# EAGLE design Main board schematics - JLC version (EAGLE 9.6.2)

## Sheet 1 of 3
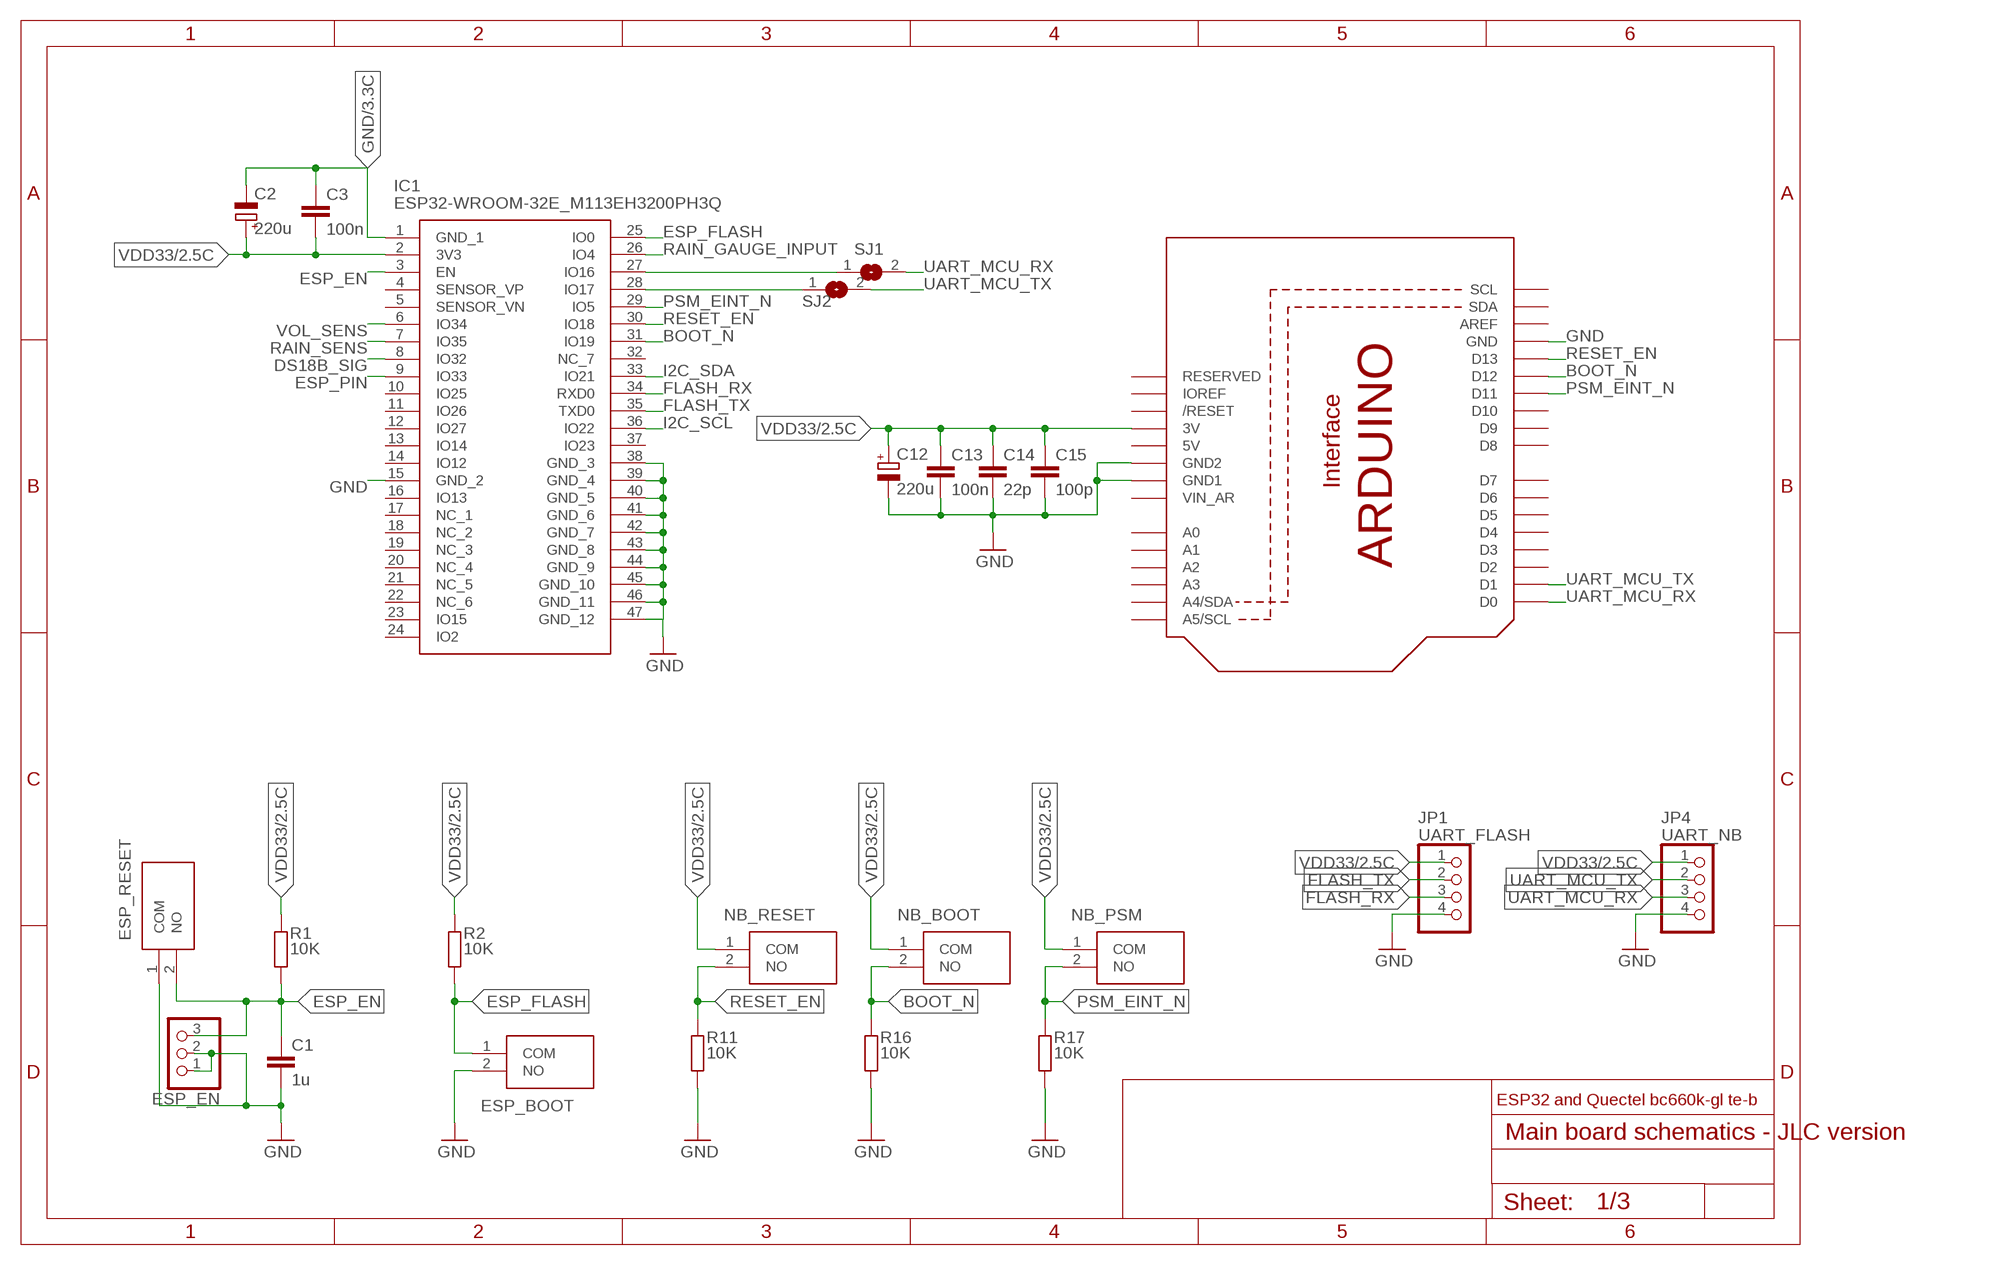
[diagram p0: schematic, sheet 1]

### Parts
C1  1u  C-EUC0805  [C0805]
C2  220u  CPOL-EUD  [PANASONIC_D]
C3  100n  C-EUC0805  [C0805]
C12  220u  CPOL-EUD  [PANASONIC_D]
C13  100n  C-EUC0805  [C0805]
C14  22p  C-EUC0805  [C0805]
C15  100p  C-EUC0805  [C0805]
ESP_BOOT  TS-1088-AR02016  [TS1088AR02016]
ESP_EN  PINHD-1X3  [1X03]
ESP_RESET  TS-1088-AR02016  [TS1088AR02016]
IC1  ESP32-WROOM-32E_M113EH3200PH3Q  [ESP32WROOM32EM113EH3200PH3Q0]
JP1  UART_FLASH  PINHD-1X4  [1X04]
JP4  UART_NB  PINHD-1X4  [1X04]
NB_BOOT  TS-1088-AR02016  [TS1088AR02016]
NB_PSM  TS-1088-AR02016  [TS1088AR02016]
NB_RESET  TS-1088-AR02016  [TS1088AR02016]
R1  10K  R-EU_R0805  [R0805]
R2  10K  R-EU_R0805  [R0805]
R11  10K  R-EU_R0805  [R0805]
R16  10K  R-EU_R0805  [R0805]
R17  10K  R-EU_R0805  [R0805]
SJ1  SJ  [SJ]
SJ2  SJ  [SJ]
U1  ARDUINOR3-BPLACE  [ARDUINOR3]

### Nets
BOOT_N: IC1.31(IO19) NB_BOOT.2(NO) R16.2 U1.D12
DS18B_SIG: IC1.8(IO32) ; also sheet 3
ESP_EN: C1.1 ESP_EN.3 ESP_RESET.2(NO) IC1.3(EN) R1.1
ESP_FLASH: ESP_BOOT.1(COM) IC1.25(IO0) R2.1
ESP_PIN: IC1.9(IO33) ; also sheet 3
FLASH_RX: IC1.34(RXD0) JP1.3
FLASH_TX: IC1.35(TXD0) JP1.2
GND: C1.2 C2.- C3.1 C12.- C13.2 C14.2 C15.2 ESP_BOOT.2(NO) ESP_EN.1 ESP_EN.2 ESP_RESET.1(COM) IC1.1(GND_1) IC1.15(GND_2) IC1.38(GND_3) IC1.39(GND_4) IC1.40(GND_5) IC1.41(GND_6) IC1.42(GND_7) IC1.43(GND_8) IC1.44(GND_9) IC1.45(GND_10) IC1.46(GND_11) IC1.47(GND_12) JP1.4 JP4.4 R11.1 R16.1 R17.1 U1.D14(GND) U1.GND U1.GND1 U1.GND2 ; also sheet 2,3
I2C_SCL: IC1.36(IO22) ; also sheet 3
I2C_SDA: IC1.33(IO21) ; also sheet 3
N$1: IC1.27(IO16) SJ1.1
N$2: IC1.28(IO17) SJ2.1
PSM_EINT_N: IC1.29(IO5) NB_PSM.2(NO) R17.2 U1.D11
RAIN_GAUGE_INPUT: IC1.26(IO4) ; also sheet 3
RAIN_SENS: IC1.7(IO35)
RESET_EN: IC1.30(IO18) NB_RESET.2(NO) R11.2 U1.D13
UART_MCU_RX: JP4.3 SJ1.2 U1.D0
UART_MCU_TX: JP4.2 SJ2.2 U1.D1
VDD33: C2.+ C3.2 C12.+ C13.1 C14.1 C15.1 IC1.2(3V3) JP1.1 JP4.1 NB_BOOT.1(COM) NB_PSM.1(COM) NB_RESET.1(COM) R1.2 R2.2 U1.VBAT(3V) ; also sheet 2,3
VOL_SENS: IC1.6(IO34) ; also sheet 3
Unconnected: IC1.4(SENSOR_VP) IC1.5(SENSOR_VN) IC1.10(IO25) IC1.11(IO26) IC1.12(IO27) IC1.13(IO14) IC1.14(IO12) IC1.16(IO13) IC1.17(NC_1) IC1.18(NC_2) IC1.19(NC_3) IC1.20(NC_4) IC1.21(NC_5) IC1.22(NC_6) IC1.23(IO15) IC1.24(IO2) IC1.32(NC_7) IC1.37(IO23) U1.A0 U1.A1 U1.A2 U1.A3 U1.A4(A4/SDA) U1.A5(A5/SCL) U1.AREF U1.D2 U1.D3 U1.D4 U1.D5 U1.D6 U1.D7 U1.D8 U1.D9 U1.D10 U1.IOREF U1.RESERVED U1.RESET(/RESET) U1.SCL U1.SDA

### Notes on the sheet
- ESP32 and Quectel bc660k-gl te-b

## Sheet 2 of 3
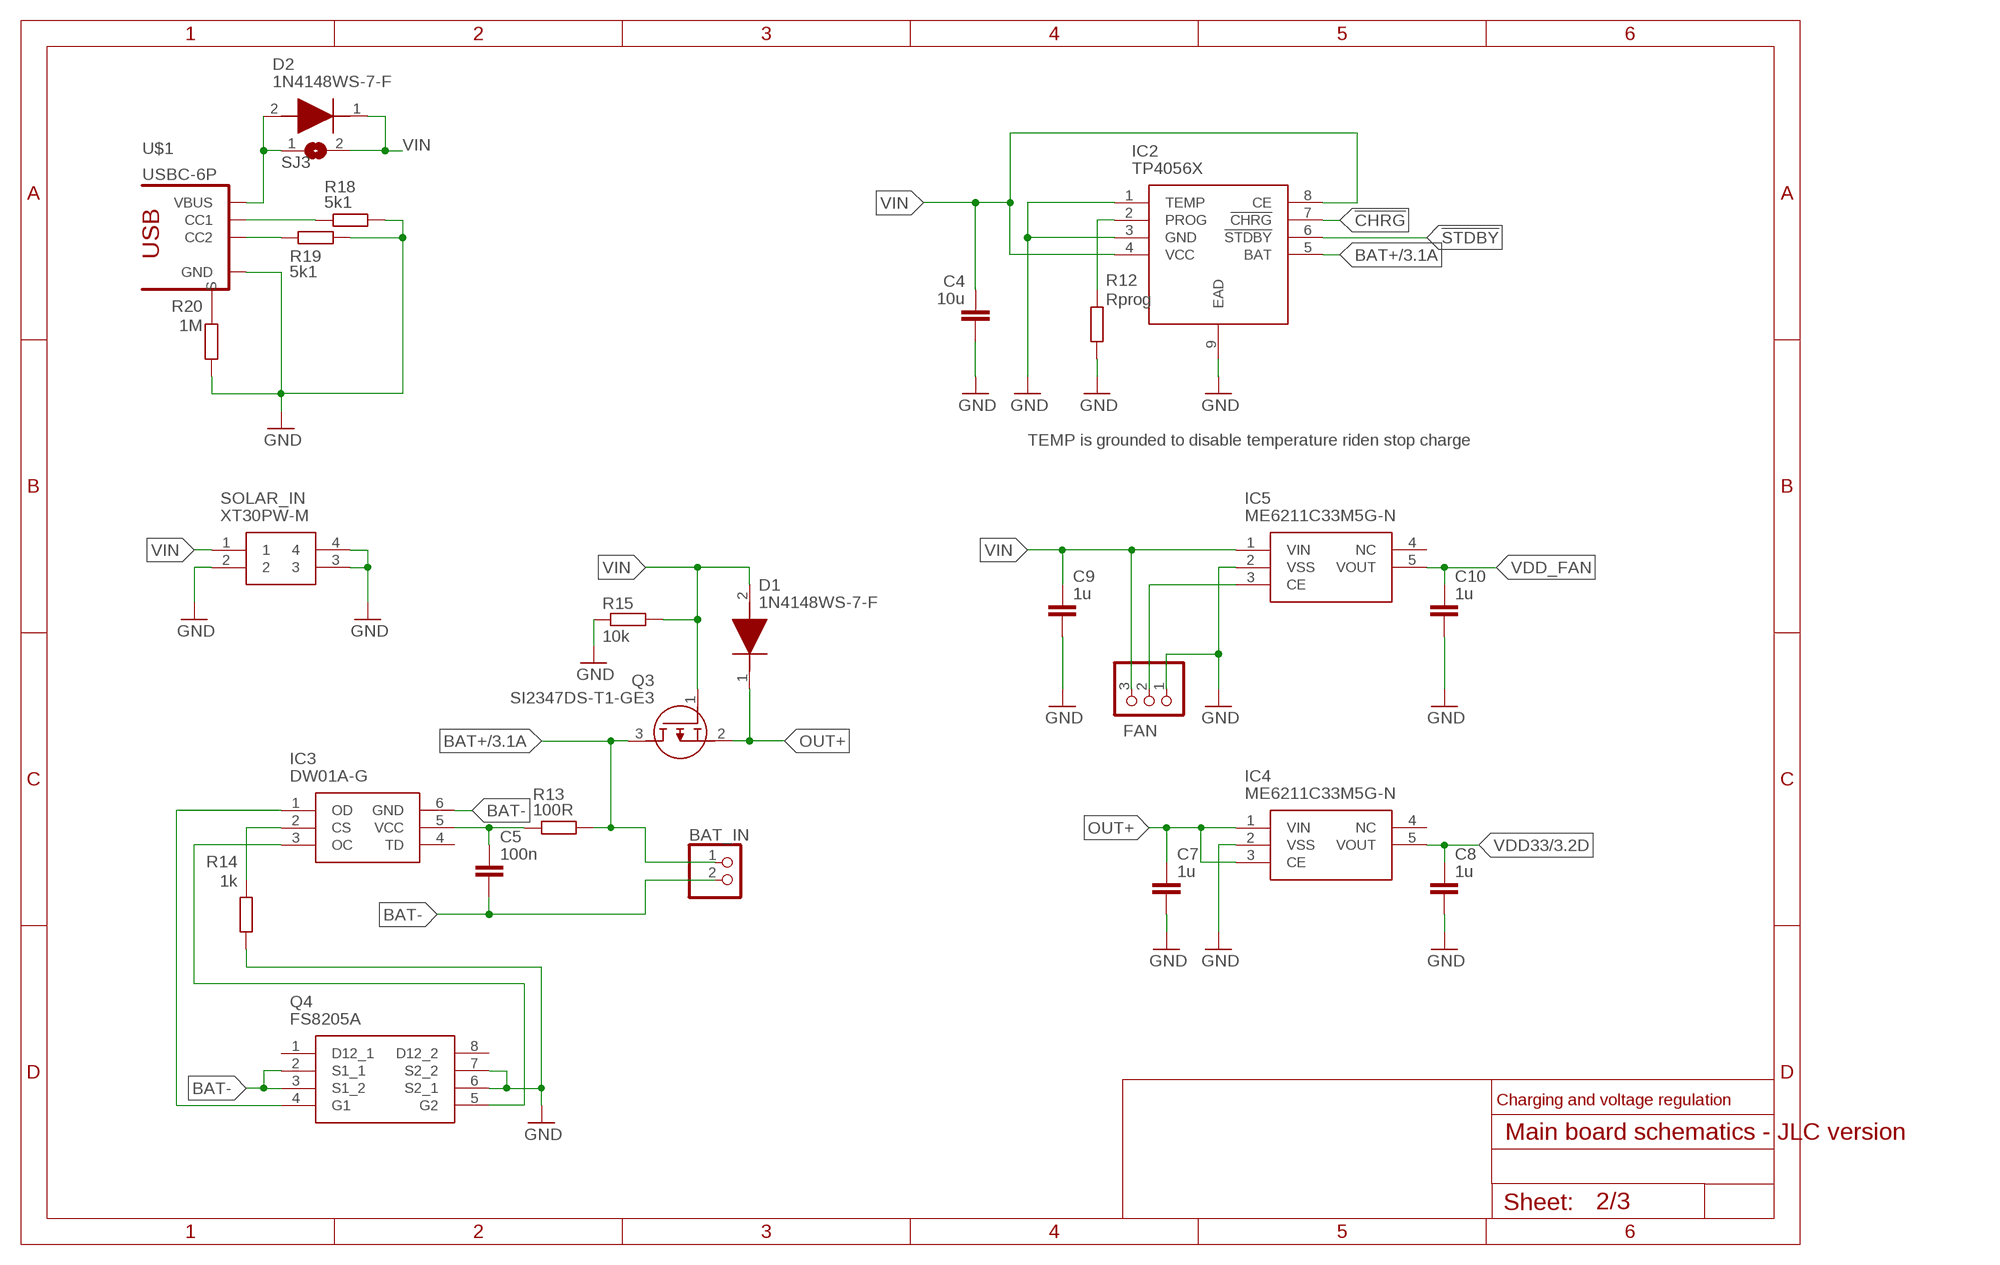
[diagram p1: schematic, sheet 2]

### Parts
BAT_IN  PINHD-1X2  [1X02]
C4  10u  C-EUC0805  [C0805]
C5  100n  C-EUC0805  [C0805]
C7  1u  C-EUC0805  [C0805]
C8  1u  C-EUC0805  [C0805]
C9  1u  C-EUC0805  [C0805]
C10  1u  C-EUC0805  [C0805]
D1  1N4148WS-7-F  [SOD2513X120N]
D2  1N4148WS-7-F  [SOD2513X120N]
FAN  PINHD-1X3  [1X03]
IC2  TP4056X  [SOIC127P600X175-9N]
IC3  DW01A-G  [SOT95P280X135-6N]
IC4  ME6211C33M5G-N  [SOT95P270X145-5N]
IC5  ME6211C33M5G-N  [SOT95P270X145-5N]
Q3  SI2347DS-T1-GE3  [SOT95P237X112-3N]
Q4  FS8205A  [SOP65P640X120-8N]
R12  Rprog  R-EU_R0805  [R0805]
R13  100R  R-EU_R0805  [R0805]
R14  1k  R-EU_R0805  [R0805]
R15  10k  R-EU_R0805  [R0805]
R18  5k1  R-EU_R0805  [R0805]
R19  5k1  R-EU_R0805  [R0805]
R20  1M  R-EU_R0805  [R0805]
SJ3  SJ  [SJ]
SOLAR_IN  XT30PW-M  [XT30PWM]
U$1  USBC-6P  [USCX-06FX-XXMX-01]

### Nets
!CHRG: IC2.7(!CHRG)
!STDBY: IC2.6(!STDBY)
BAT+: BAT_IN.1 IC2.5(BAT) Q3.3(D) R13.2 ; also sheet 3
BAT-: BAT_IN.2 C5.2 IC3.6(GND) Q4.2(S1_1) Q4.3(S1_2)
GND: C4.2 C7.2 C8.2 C9.2 C10.2 FAN.1 IC2.1(TEMP) IC2.3(GND) IC2.9(EAD) IC4.2(VSS) IC5.2(VSS) Q4.6(S2_1) Q4.7(S2_2) R12.2 R14.1 R15.1 R18.1 R19.1 R20.2 SOLAR_IN.2 SOLAR_IN.3 SOLAR_IN.4 U$1.GND1(GND) U$1.GND2(GND) ; also sheet 1,3
N$4: IC2.2(PROG) R12.1
N$5: D2.2(A) SJ3.1 U$1.VBUS1(VBUS) U$1.VBUS2(VBUS)
N$6: FAN.2 IC5.3(CE)
N$7: C5.1 IC3.5(VCC) R13.1
N$8: R20.1 U$1.SHIELD1(S) U$1.SHIELD2(S) U$1.SHIELD3(S) U$1.SHIELD4(S)
N$9: IC3.2(CS) R14.2
N$10: IC3.1(OD) Q4.4(G1)
N$11: R19.2 U$1.CC2
N$12: IC3.3(OC) Q4.5(G2)
N$13: R18.2 U$1.CC1
OUT+: C7.1 D1.1(K) IC4.1(VIN) IC4.3(CE) Q3.2(S)
VDD33: C8.1 IC4.5(VOUT) ; also sheet 1,3
VDD_FAN: C10.1 IC5.5(VOUT) ; also sheet 3
VIN: C4.1 C9.1 D1.2(A) D2.1(K) FAN.3 IC2.4(VCC) IC2.8(CE) IC5.1(VIN) Q3.1(G) R15.2 SJ3.2 SOLAR_IN.1
Unconnected: IC3.4(TD) IC4.4(NC) IC5.4(NC) Q4.1(D12_1) Q4.8(D12_2)

### Notes on the sheet
- TEMP is grounded to disable temperature riden stop charge
- Charging and voltage regulation

## Sheet 3 of 3
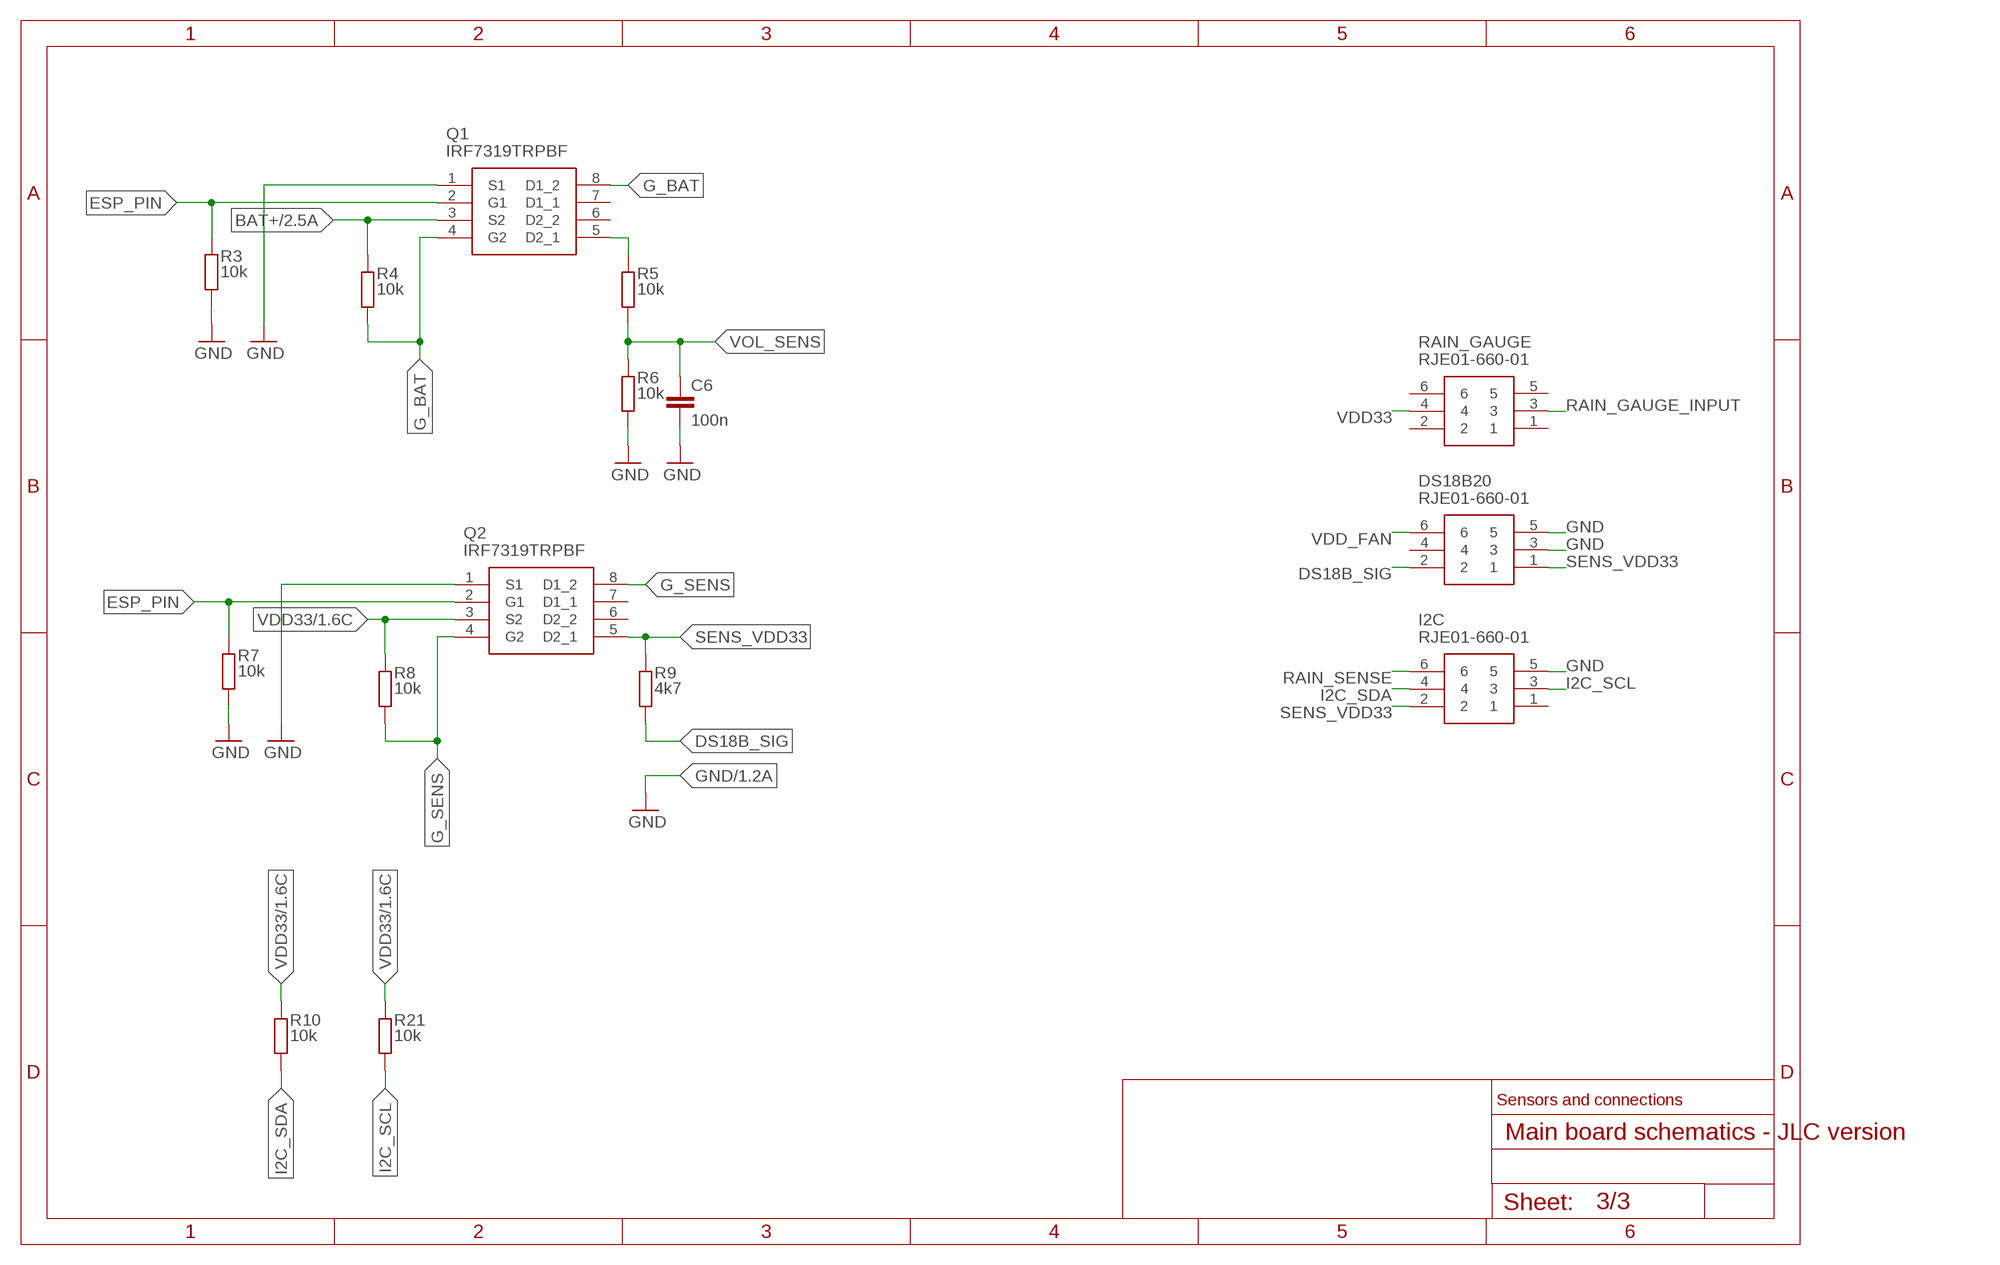
[diagram p2: schematic, sheet 3]

### Parts
C6  100n  C-EUC0805  [C0805]
DS18B20  RJE01-660-01  [RJE0166001]
I2C  RJE01-660-01  [RJE0166001]
Q1  IRF7319TRPBF  [SOIC127P600X175-8N]
Q2  IRF7319TRPBF  [SOIC127P600X175-8N]
R3  10k  R-EU_R0805  [R0805]
R4  10k  R-EU_R0805  [R0805]
R5  10k  R-EU_R0805  [R0805]
R6  10k  R-EU_R0805  [R0805]
R7  10k  R-EU_R0805  [R0805]
R8  10k  R-EU_R0805  [R0805]
R9  4k7  R-EU_R0805  [R0805]
R10  10k  R-EU_R0805  [R0805]
R21  10k  R-EU_R0805  [R0805]
RAIN_GAUGE  RJE01-660-01  [RJE0166001]

### Nets
BAT+: Q1.3(S2) R4.1 ; also sheet 2
DS18B_SIG: DS18B20.2 R9.1 ; also sheet 1
ESP_PIN: Q1.2(G1) Q2.2(G1) R3.2 R7.2 ; also sheet 1
G_BAT: Q1.4(G2) Q1.8(D1_2) R4.2
G_SENS: Q2.4(G2) Q2.8(D1_2) R8.2
GND: C6.2 DS18B20.3 DS18B20.5 I2C.5 Q1.1(S1) Q2.1(S1) R3.1 R6.1 R7.1 ; also sheet 1,2
I2C_SCL: I2C.3 R21.1 ; also sheet 1
I2C_SDA: I2C.4 R10.1 ; also sheet 1
N$3: Q1.5(D2_1) R5.2
RAIN_GAUGE_INPUT: RAIN_GAUGE.3 ; also sheet 1
RAIN_SENSE: I2C.6
SENS_VDD33: DS18B20.1 I2C.2 Q2.5(D2_1) R9.2
VDD33: Q2.3(S2) R8.1 R10.2 R21.2 RAIN_GAUGE.4 ; also sheet 1,2
VDD_FAN: DS18B20.6 ; also sheet 2
VOL_SENS: C6.1 R5.1 R6.2 ; also sheet 1
Unconnected: DS18B20.4 I2C.1 Q1.6(D2_2) Q1.7(D1_1) Q2.6(D2_2) Q2.7(D1_1) RAIN_GAUGE.1 RAIN_GAUGE.2 RAIN_GAUGE.5 RAIN_GAUGE.6

### Notes on the sheet
- Sensors and connections

## Power pins joined to a net without a drawn wire
5V: U1.5V
VIN_AR: U1.VIN_AR

## Library data of the parts
BAT_IN = pinhead:PINHD-1X2: PIN HEADER
C1 C3-C10 C13-C15 = rcl:C-EU: CAPACITOR, European symbol; SPICEPREFIX: C
C2 C12 = rcl:CPOL-EU: POLARIZED CAPACITOR, European symbol; SPICEPREFIX: C
D1 D2 = 1-component-search:1N4148WS-7-F: Diode Switching 150mA 75V 200mW SOD323 Diodes Inc 1N4148WS-7-F Switching Diode, 150mA 75V, 2-Pin SOD-323 Source: Datasheet <https://componentsearchengine.com/Datasheets/2/1N4148WS-7-F.pdf>; ARROW_PART_NUMBER: 1N4148WS-7-F; ARROW_PRICE-STOCK: https://www.arrow.com/en/products/1n4148ws-7-f/diodes-incorporated?region=nac; DESCRIPTION: Diode Switching 150mA 75V 200mW SOD323 Diodes Inc 1N4148WS-7-F Switching Diode, 150mA 75V, 2-Pin SOD-323; HEIGHT: 1.2mm; MANUFACTURER_NAME: Diodes Inc.; MANUFACTURER_PART_NUMBER: 1N4148WS-7-F; MOUSER_PART_NUMBER: 621-1N4148WS-F; MOUSER_PRICE-STOCK: https://www.mouser.co.uk/ProductDetail/Diodes-Incorporated/1N4148WS-7-F?qs=4drIV0IxA0r8aNy7%2Fu4kVw%3D%3D
DS18B20 I2C RAIN_GAUGE = 1-component-search:RJE01-660-01: Modular Connectors / Ethernet Connectors Mod Jack Cat3 RJ11 Gold Source: Datasheet <https://www.mouser.com/datasheet/2/18/amphenol_RJE016X001-1157271.pdf>; ARROW_PART_NUMBER: RJE01-660-01; ARROW_PRICE-STOCK: https://www.arrow.com/en/products/rje01-660-01/amphenol-fci?region=nac; DESCRIPTION: Modular Connectors / Ethernet Connectors Mod Jack Cat3 RJ11 Gold; HEIGHT: 12.88mm; MANUFACTURER_NAME: Amphenol; MANUFACTURER_PART_NUMBER: RJE01-660-01; MOUSER_PART_NUMBER: 523-RJE01-660-01; MOUSER_PRICE-STOCK: https://www.mouser.co.uk/ProductDetail/Amphenol-Commercial-Products/RJE01-660-01?qs=St27ATL478szj4V93DJo9w%3D%3D
ESP_BOOT ESP_RESET NB_BOOT NB_PSM NB_RESET = 1-component-search:TS-1088-AR02016: Tact Switch Source: Datasheet <https://www.xunpudianzi.com/uploads/pdf/TS-1088-ARXXX.pdf>; DESCRIPTION: Tact Switch; HEIGHT: 2mm; MANUFACTURER_NAME: XUNPU; MANUFACTURER_PART_NUMBER: TS-1088-AR02016
ESP_EN FAN = pinhead:PINHD-1X3: PIN HEADER
IC1 = 1-component-search:ESP32-WROOM-32E_M113EH3200PH3Q: WiFi Modules (802.11) SMD Module ESP32-D0WD-V3, 4 MB SPI flash, PCB antenna Source: Datasheet <https://www.mouser.com/datasheet/2/891/esp32-wroom-32e_esp32-wroom-32ue_datasheet_en-1855879.pdf>; DESCRIPTION: WiFi Modules (802.11) SMD Module ESP32-D0WD-V3, 4 MB SPI flash, PCB antenna; HEIGHT: 3.25mm; MANUFACTURER_NAME: Espressif Systems; MANUFACTURER_PART_NUMBER: ESP32-WROOM-32E(M113EH3200PH3Q0); MOUSER_PART_NUMBER: 356-ESP32WRM32E132PH; MOUSER_PRICE-STOCK: https://www.mouser.co.uk/ProductDetail/Espressif-Systems/ESP32-WROOM-32EM113EH3200PH3Q0?qs=vHuUswq2%252Bsx8Xcp7bzmaHA%3D%3D
IC2 = TP4056X:TP4056X: PMIC - Battery Management SOP-8_EP_150mil RoHS Source: Datasheet <https://datasheet.lcsc.com/szlcsc/Nanjing-Extension-Microelectronics-TP4056X_C191323.pdf>; DESCRIPTION: PMIC - Battery Management SOP-8_EP_150mil RoHS; HEIGHT: 1.75mm; MANUFACTURER_NAME: Nanjing Extension Microelectronics; MANUFACTURER_PART_NUMBER: TP4056X
IC3 = 1-component-search:DW01A-G: One Cell Lithium-ion/Polymer Battery Protection IC Source: Datasheet <http://acoptex.com/uploads/DW01A.pdf>; DESCRIPTION: One Cell Lithium-ion/Polymer Battery Protection IC; HEIGHT: 1.35mm; MANUFACTURER_NAME: Fortune Semiconductor Corporation; MANUFACTURER_PART_NUMBER: DW01A-G
IC4 IC5 = 1-component-search:ME6211C33M5G-N: Fixed 6V 3.3V 500mA SOT-23-5 Low Dropout Regulators(LDO) RoHS Source: Datasheet <https://datasheet.lcsc.com/szlcsc/1811131510_MICRONE-Nanjing-Micro-One-Elec-ME6211C33M5G-N_C82942.pdf>; DESCRIPTION: Fixed 6V 3.3V 500mA SOT-23-5 Low Dropout Regulators(LDO) RoHS; HEIGHT: 1.45mm; MANUFACTURER_NAME: Microne; MANUFACTURER_PART_NUMBER: ME6211C33M5G-N
JP1 JP4 = pinhead:PINHD-1X4: PIN HEADER
Q1 Q2 = 1-component-search:IRF7319TRPBF: IRF7319TRPBF Dual N/P-Channel MOSFET, 4.9 A, 6.5 A, 30 V HEXFET, 8-Pin SOIC Infineon Source: Datasheet <https://www.infineon.com/dgdl/irf7319pbf.pdf?fileId=5546d462533600a4015355f5c82f1b41>; ARROW_PART_NUMBER: IRF7319TRPBF; ARROW_PRICE-STOCK: https://www.arrow.com/en/products/irf7319trpbf/infineon-technologies-ag?region=nac; DESCRIPTION: IRF7319TRPBF Dual N/P-Channel MOSFET, 4.9 A, 6.5 A, 30 V HEXFET, 8-Pin SOIC Infineon; HEIGHT: 1.75mm; MANUFACTURER_NAME: Infineon; MANUFACTURER_PART_NUMBER: IRF7319TRPBF; MOUSER_PART_NUMBER: 942-IRF7319TRPBF; MOUSER_PRICE-STOCK: https://www.mouser.co.uk/ProductDetail/Infineon-IR/IRF7319TRPBF?qs=9%252BKlkBgLFf3yLUxG6ZIMRA%3D%3D
Q3 = 1-component-search:SI2347DS-T1-GE3: P-Ch MOSFET SOT-23 copper 30V 42mohm @ 1 Source: Datasheet <https://www.vishay.com/docs/62827/si2347ds.pdf>; ARROW_PART_NUMBER: SI2347DS-T1-GE3; ARROW_PRICE-STOCK: https://www.arrow.com/en/products/si2347ds-t1-ge3/vishay?region=nac; DESCRIPTION: P-Ch MOSFET SOT-23 copper 30V 42mohm @ 1; HEIGHT: 1.12mm; MANUFACTURER_NAME: Vishay; MANUFACTURER_PART_NUMBER: Si2347DS-T1-GE3; MOUSER_PART_NUMBER: 78-SI2347DS-T1-GE3; MOUSER_PRICE-STOCK: https://www.mouser.co.uk/ProductDetail/Vishay-Semiconductors/SI2347DS-T1-GE3?qs=wnm%2FPMJNddFQv4lfacOrcA%3D%3D
Q4 = 1-component-search:FS8205A: Dual N-Channel Enahncement Mode Power MOSFET Source: Datasheet <http://www.ic-fortune.com/upload/Download/FS8205A-DS-12_EN.pdf>; DESCRIPTION: Dual N-Channel Enahncement Mode Power MOSFET; HEIGHT: 1.2mm; MANUFACTURER_NAME: fortune; MANUFACTURER_PART_NUMBER: FS8205A
R1-R21 = rcl:R-EU_: RESISTOR, European symbol; SPICEPREFIX: R
SJ1-SJ3 = jumper:SJ: SMD solder JUMPER
SOLAR_IN = 1-component-search:XT30PW-M: 30A Low Temperature Rise Fire Retardant Plug Source: Datasheet <https://www.tme.eu/sl/Document/ce4077e36b79046da520ca73227e15de/XT30PW SPEC.pdf>; DESCRIPTION: 30A Low Temperature Rise Fire Retardant Plug; HEIGHT: 5mm; MANUFACTURER_NAME: Amass; MANUFACTURER_PART_NUMBER: XT30PW-M
U1 = 1-component-search:ARDUINOR3: Arduin R3 interface
U$1 = USBC6P:USBC-6P: AliExpress Special! Connect 5.1k 10% resistors to each CC pin, pulled up to 3.3v or 5.0v.

## Module A
Ports: 

### Library data of the parts

## Net classes
0 default: clearance 0.205 mm

## Board
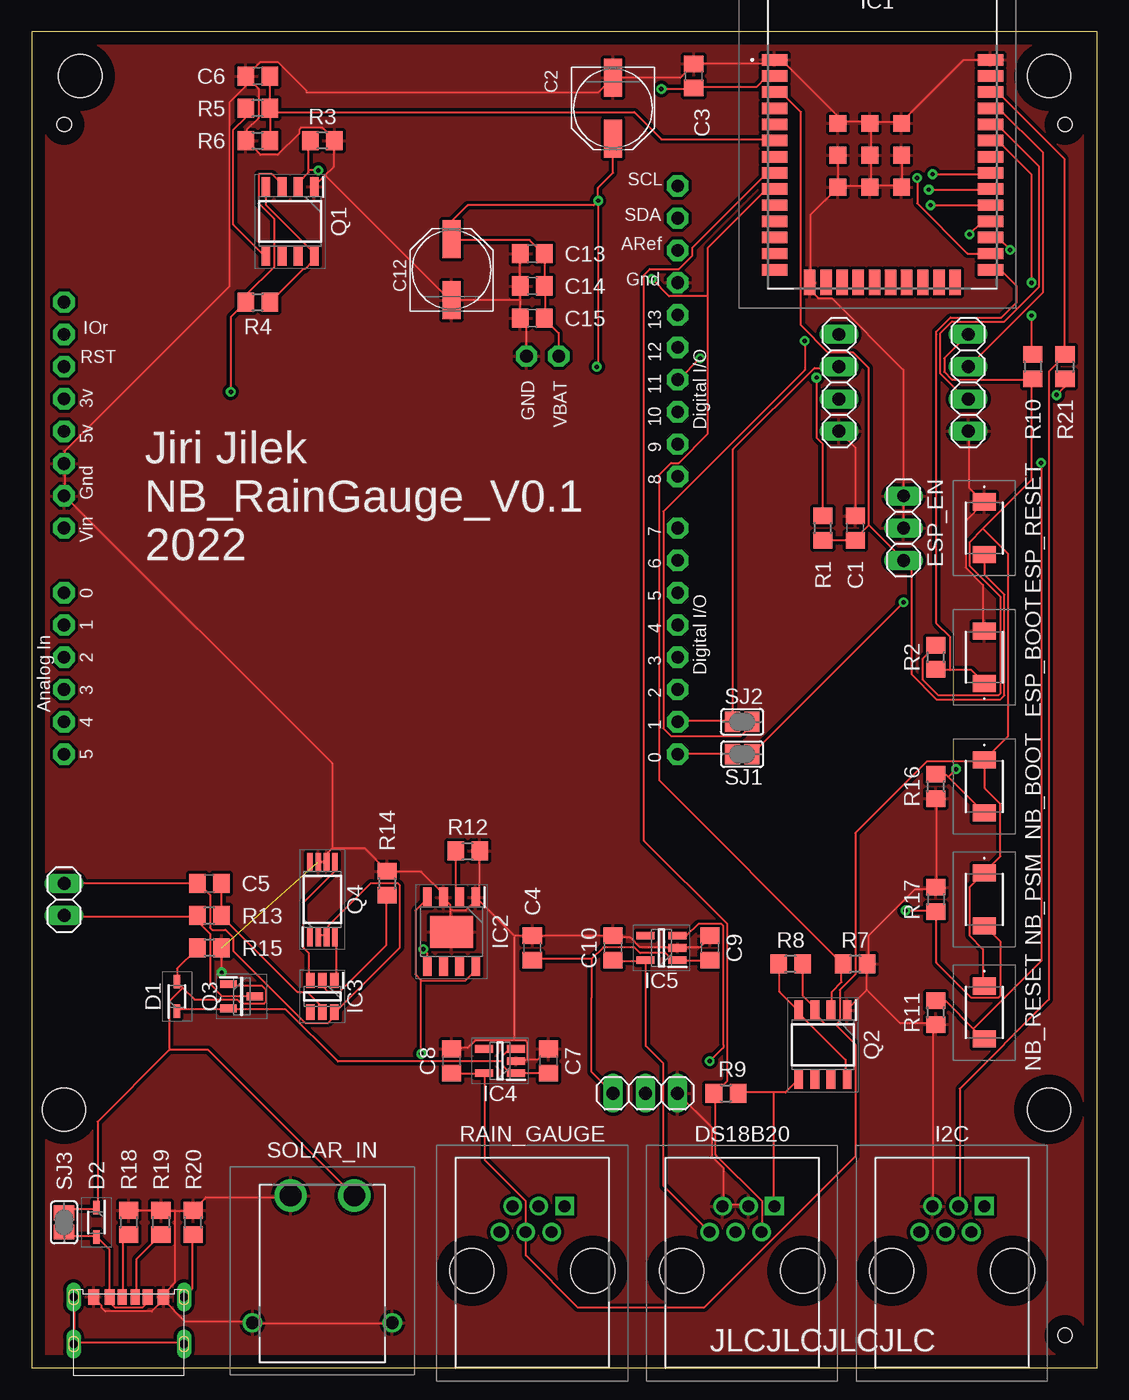
[diagram p3: board, top side]
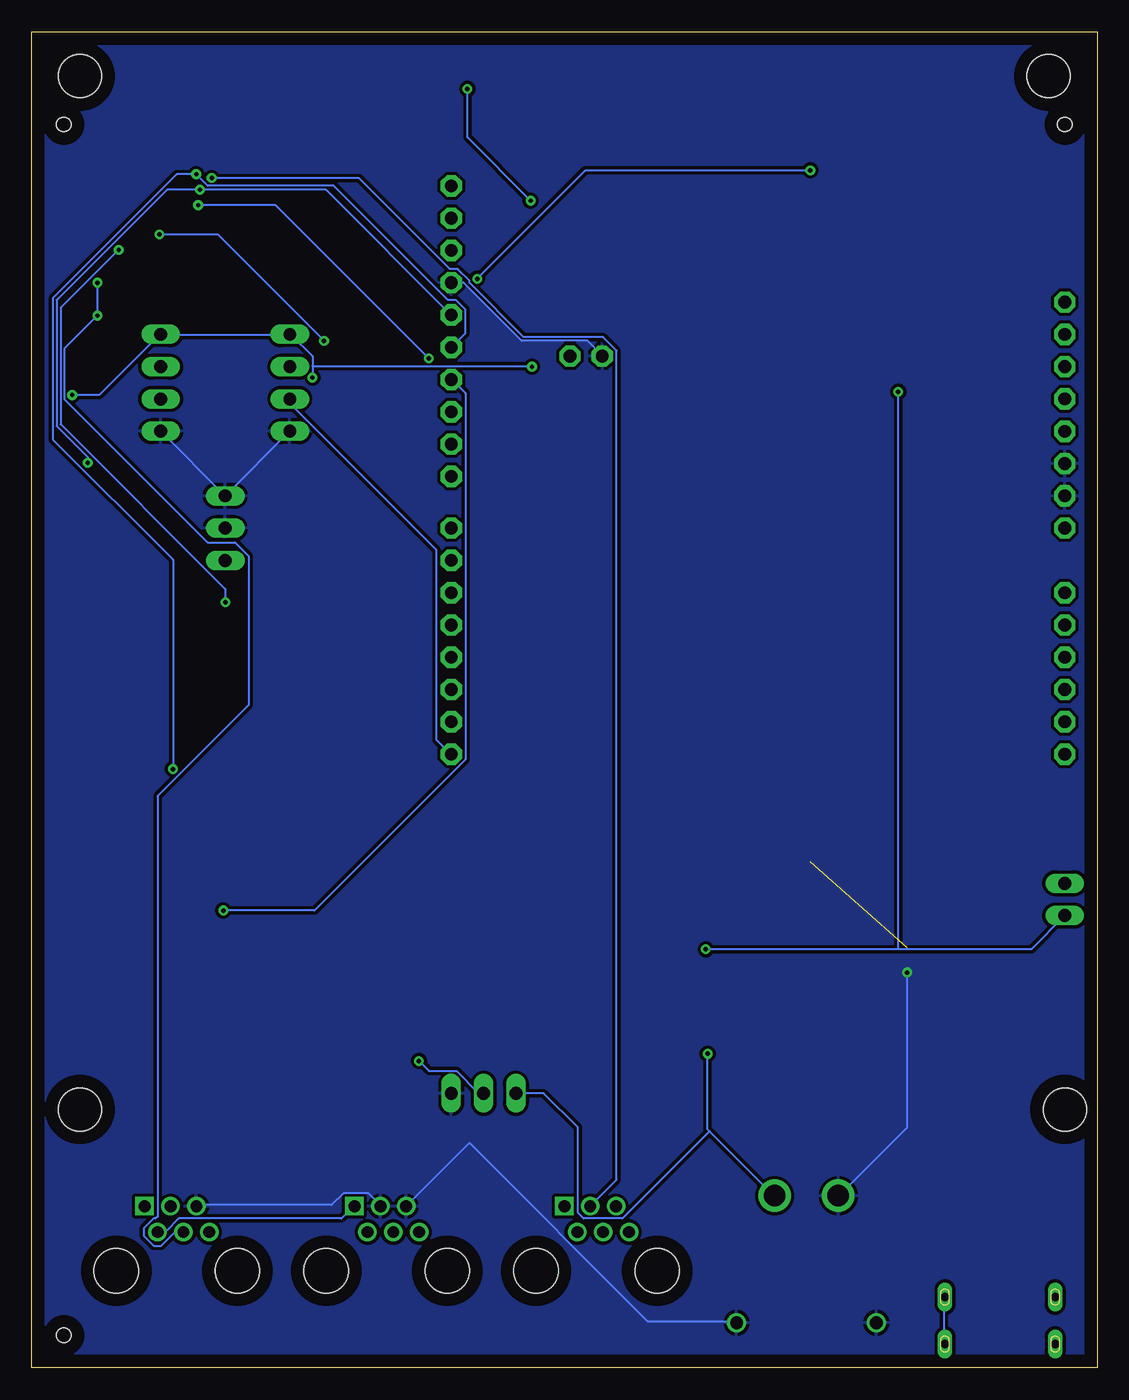
[diagram p4: board, bottom side, seen from below]

Size 83.8 x 105.08 mm. Coordinates in mm from the lower left corner, seen from the top.
Outline: 0,0 83.8,0 83.8,105.08 0,105.08 0,0
Copper layers (1*16): Top 0.035mm / dielectric 1.5mm / Bottom 0.035mm
Design rules "default": minimum track width 6mil, minimum drill 0.35mm, track to track 6mil, track to pad 6mil, pad to pad 6mil, via to via 6mil, smd to smd 6mil, copper to edge 40mil, drill to drill 6mil, minimum pad ring 10mil, minimum via ring 8mil, stop-mask expansion 4mil, vias tented up to drill 0mil, thermal gap 10mil
Holes 3.4 mm at 80.01,101.6 3.81,101.6 2.54,20.32 80.01,20.32
Holes 1.15 mm at 81.28,2.54 2.54,97.79 81.28,97.79

### Footprints (pad centres in the part's own frame; a part is rotated, then mirrored left to right if it is on the bottom)
1X02 = drill 1.016 long: 1 -1.27,0; 2 1.27,0
C0805 = smd 1.3 x 1.5: 1 -0.95,0; 2 0.95,0
PANASONIC_D = smd 3 x 1.4: + 2.4,0; - -2.4,0
SOD2513X120N = smd 1.075 x 0.5: 1 -1.162,0; 2 1.162,0
RJE0166001 = drill 0.94 pad 1.462 square: 1 0,0 | drill 0.94 pad 1.462: 2 -1.02,-2.03; 3 -2.04,0; 4 -3.06,-2.03; 5 -4.08,0; 6 -5.1,-2.03 | hole 3.5: 2.22,-5.08; -7.3,-5.08
TS1088AR02016 = smd 1.35 x 1.8: 1 -2.075,0; 2 2.075,0
1X03 = drill 1.016 long: 1 -2.54,0; 2 0,0; 3 2.54,0
ESP32WROOM32EM113EH3200PH3Q0 = smd 2 x 0.9: 1 0,0; 2 0,-1.27; 3 0,-2.54; 4 0,-3.81; 5 0,-5.08; 6 0,-6.35; 7 0,-7.62; 8 0,-8.89; 9 0,-10.16; 10 0,-11.43; 11 0,-12.7; 12 0,-13.97; 13 0,-15.24; 14 0,-16.51; 25 17,-16.51; 26 17,-15.24; 27 17,-13.97; 28 17,-12.7; 29 17,-11.43; 30 17,-10.16; 31 17,-8.89; 32 17,-7.62; 33 17,-6.35; 34 17,-5.08; 35 17,-3.81; 36 17,-2.54; 37 17,-1.27; 38 17,0 | smd 0.9 x 2: 15 2.785,-17.51; 16 4.055,-17.51; 17 5.325,-17.51; 18 6.595,-17.51; 19 7.865,-17.51; 20 9.135,-17.51; 21 10.405,-17.51; 22 11.675,-17.51; 23 12.945,-17.51; 24 14.215,-17.51 | smd 1.33 x 1.33: 39 5,-5; 40 5,-7.5; 41 5,-10; 42 7.5,-10; 43 7.5,-7.5; 44 7.5,-5; 45 10,-5; 46 10,-7.5; 47 10,-10
SOIC127P600X175-9N = smd 1.525 x 0.7: 1 -2.712,1.905; 2 -2.712,0.635; 3 -2.712,-0.635; 4 -2.712,-1.905; 5 2.712,-1.905; 6 2.712,-0.635; 7 2.712,0.635; 8 2.712,1.905 | smd 2.513 x 3.402: 9 0,0
SOT95P280X135-6N = smd 1.2 x 0.65: 1 -1.25,0.95; 2 -1.25,0; 3 -1.25,-0.95; 4 1.25,-0.95; 5 1.25,0; 6 1.25,0.95
SOT95P270X145-5N = smd 1.4 x 0.6: 1 -1.25,0.95; 2 -1.25,0; 3 -1.25,-0.95; 4 1.25,-0.95; 5 1.25,0.95
1X04 = drill 1.016 long: 1 -3.81,0; 2 -1.27,0; 3 1.27,0; 4 3.81,0
SOIC127P600X175-8N = smd 1.525 x 0.7: 1 -2.712,1.905; 2 -2.712,0.635; 3 -2.712,-0.635; 4 -2.712,-1.905; 5 2.712,-1.905; 6 2.712,-0.635; 7 2.712,0.635; 8 2.712,1.905
SOT95P237X112-3N = smd 1.3 x 0.6: 1 -1.05,0.95; 2 -1.05,-0.95; 3 1.05,0
SOP65P640X120-8N = smd 1.475 x 0.45: 1 -2.938,0.975; 2 -2.938,0.325; 3 -2.938,-0.325; 4 -2.938,-0.975; 5 2.938,-0.975; 6 2.938,-0.325; 7 2.938,0.325; 8 2.938,0.975
R0805 = smd 1.3 x 1.5: 1 -0.95,0; 2 0.95,0
SJ = smd 1.168 x 1.6: 1 -0.762,0; 2 0.762,0
XT30PWM = drill 1.7 pad 2.55: 1 -2.5,-5.912; 2 2.5,-5.912 | drill 1 pad 1.5: 3 5.5,4.088; 4 -5.5,4.088
ARDUINOR3 = drill 1 pad 1.676 octagon: 3V 35.56,2.54; 5V 38.1,2.54; A0 50.8,2.54; A1 53.34,2.54; A2 55.88,2.54; A3 58.42,2.54; A4 60.96,2.54; A5 63.5,2.54; AREF 23.876,50.8; D0 63.5,50.8; D1 60.96,50.8; D2 58.42,50.8; D3 55.88,50.8; D4 53.34,50.8; D5 50.8,50.8; D6 48.26,50.8; D7 45.72,50.8; D8 41.656,50.8; D9 39.116,50.8; D10 36.576,50.8; D11 34.036,50.8; D12 31.496,50.8; D13 28.956,50.8; D14 32.19,38.92; GND 26.416,50.8; GND1 43.18,2.54; GND2 40.64,2.54; IOREF 30.48,2.54; RESERVED 27.94,2.54; RESET 33.02,2.54; SCL 18.796,50.8; SDA 21.336,50.8; VBAT 32.19,41.46; VIN_AR 45.72,2.54
USCX-06FX-XXMX-01 = smd 0.7 x 1.2: CC1 0.5,-1.75; CC2 -0.5,-1.75 | smd 0.9 x 1.2: GND1 2.75,-1.75; GND2 -2.75,-1.75 | drill 0.65 pad 1.092 long: SHIELD1 4.325,1.95; SHIELD2 4.325,-1.75; SHIELD3 -4.35,-1.75; SHIELD4 -4.35,1.95 | smd 0.8 x 1.2: VBUS1 1.5,-1.75; VBUS2 -1.5,-1.75

### Placement (x,y rotation side)
BAT_IN  2.54,36.83 90 top
C1  64.77,66.04 90 top
C2  45.72,99.06 270 top
C3  52.07,101.6 270 top
C4  39.37,33.02 90 top
C5  13.97,38.1 180 top
C6  17.78,101.6 180 top
C7  40.64,24.13 90 top
C8  33.02,24.13 90 top
C9  53.34,33.02 90 top
C10  45.72,33.02 90 top
C12  33.02,86.36 90 top
C13  39.37,87.63 180 top
C14  39.37,85.09 180 top
C15  39.37,82.55 180 top
D1  11.43,29.21 90 top
D2  5.08,11.43 270 top
DS18B20  58.42,12.7 0 top
ESP_BOOT  74.93,55.88 90 top
ESP_EN  68.58,66.04 270 top
ESP_RESET  74.93,66.04 270 top
FAN  48.26,21.59 180 top
I2C  74.93,12.7 0 top
IC1  58.42,102.87 0 top
IC2  33.02,34.29 270 top
IC3  22.86,29.21 270 top
IC4  36.83,24.13 180 top
IC5  49.53,33.02 180 top
JP1  73.66,77.47 270 top
JP4  63.5,77.47 270 top
NB_BOOT  74.93,45.72 270 top
NB_PSM  74.93,36.83 270 top
NB_RESET  74.93,27.94 270 top
Q1  20.32,90.17 270 top
Q2  62.23,25.4 270 top
Q3  16.51,29.21 0 top
Q4  22.86,36.83 90 top
R1  62.23,66.04 90 top
R2  71.12,55.88 90 top
R3  22.86,96.52 180 top
R4  17.78,83.82 0 top
R5  17.78,99.06 180 top
R6  17.78,96.52 0 top
R7  64.77,31.75 180 top
R8  59.69,31.75 180 top
R9  54.61,21.59 0 top
R10  78.74,78.74 270 top
R11  71.12,27.94 90 top
R12  34.29,40.64 0 top
R13  13.97,35.56 180 top
R14  27.94,38.1 270 top
R15  13.97,33.02 180 top
R16  71.12,45.72 90 top
R17  71.12,36.83 270 top
R18  7.62,11.43 270 top
R19  10.16,11.43 270 top
R20  12.7,11.43 90 top
R21  81.28,78.74 270 top
RAIN_GAUGE  41.91,12.7 0 top
SJ1  55.88,48.26 180 top
SJ2  55.88,50.8 180 top
SJ3  2.54,11.43 90 top
SOLAR_IN  22.86,7.62 180 top
U1  0,111.76 270 top
U$1  7.62,3.81 180 top

### Tracks (layer width: path | path; a pad name or v marks a point on that pad's centre or on a via)
BAT+  (via drill 0.35)
  Top 0.152: Q1.3 19.81,92.96 18.9,93.88 17.83,93.88 17.83,91.59 19.05,90.37 19.05,86.56 16.92,84.43 16.92,83.82 R4.1 15.65,82.64 v15.65,76.76 | Q3.3 17.53,29.26 14.94,29.26 14.02,30.18 14.02,34.14 13.11,35.05 13.11,35.51 R13.2 12.95,35.51 2.59,35.51 BAT_IN.1 | v30.79,32.92 31.09,32.61 31.09,31.7 IC2.5
  Bottom 0.152: 15.65,32.92 5.18,32.92 BAT_IN.1 | 15.65,32.92 v30.79,32.92 | 15.65,32.92 v15.65,76.76
BAT-
  Top 0.152: Q4.2 22.55,33.98 23.16,33.98 Q4.3 23.32,33.98 23.32,34.75 26.67,38.1 28.8,38.1 28.96,37.95 28.96,33.07 23.93,28.04 IC3.6 23.77,27.89 23.77,27.58 23.32,27.13 21.49,27.13 15.85,32.77 15.85,33.83 15.24,34.44 14.17,34.44 14.02,34.59 14.02,37.19 13.11,38.1 C5.2 BAT_IN.2
BOOT_N  (via drill 0.35)
  Top 0.152: 72.08,46.48 74.83,43.74 NB_BOOT.2 | 72.08,46.48 71.93,46.63 71.17,46.63 R16.2 | v70.87,93.88 75.29,93.88 IC1.31 | v72.69,47.09 72.08,46.48
  Bottom 0.152: U1.D12 49.68,81.38 49.68,83.21 50.44,83.97 51.05,83.97 60.05,92.96 69.95,92.96 v70.87,93.88 72.39,93.88 82.14,84.12 82.14,73 72.69,63.55 v72.69,47.09
DS18B_SIG
  Top 0.152: DS18B20.2 57.45,10.82 57.45,13.11 53.8,16.76 53.8,21.49 R9.1 53.8,21.64 54.71,22.55 54.71,34.9 48.16,41.45 48.16,85.95 48.62,86.41 50.9,86.41 51.97,87.48 51.97,88.09 57.76,93.88 58.37,93.88 IC1.8
ESP_EN
  Top 0.152: ESP_RESET.2 74.98,63.86 74.98,62.33 76.5,60.81 76.5,52.88 76.2,52.58 71.17,52.58 69.19,54.56 69.19,62.79 68.58,63.4 ESP_EN.3 68.58,63.55 65.84,66.29 | R1.1 62.33,65.08 64.77,65.08 C1.1 64.77,65.23 65.84,66.29 | 65.84,66.29 65.84,78.64 64.62,79.86 62.64,79.86 60.5,81.99 60.5,98.75 58.98,100.28 58.52,100.28 IC1.3
ESP_FLASH
  Top 0.152: 72.24,54.86 73.91,54.86 74.83,53.95 ESP_BOOT.1 | 72.24,54.86 71.17,54.86 R2.1 | 71.17,81.51 71.17,81.53 | 72.24,54.86 72.24,57.45 71.17,58.52 71.17,81.28 71.17,81.51 | 71.17,81.51 72.26,82.6 76.25,82.6 77.47,83.82 77.47,85.09 76.2,86.36 IC1.25
ESP_PIN  (via drill 0.35)
  Top 0.152: 21.79,94.18 21.79,94.03 21.03,93.27 21.03,92.96 Q1.2 | 21.79,94.18 21.79,96.47 R3.2 | Q2.2 62.94,28.19 62.94,29.57 63.7,30.33 63.7,31.7 R7.2 63.7,31.85 49.38,46.18 49.38,70.26 50.29,71.17 50.9,71.17 53.19,73.46 53.19,84.28 | 53.19,84.28 53.19,88.09 57.76,92.66 58.37,92.66 IC1.9 | v22.55,94.18 21.79,94.18 | v48.77,85.65 50.14,84.28 53.19,84.28
  Bottom 0.152: v22.55,94.18 40.23,94.18 v48.77,85.65
FLASH_RX
  Top 0.152: JP1.3 73.46,76.2 71.48,78.18 71.48,81.38 72.39,82.3 76.5,82.3 79.25,85.04 79.25,94.49 76.05,97.69 75.44,97.69 IC1.34
FLASH_TX
  Top 0.152: IC1.35 76.05,99.06 79.55,95.56 79.55,84.58 73.76,78.79 JP1.2
G_BAT
  Top 0.152: R4.2 18.75,83.82 21.34,86.41 21.49,86.41 22.1,87.02 22.1,87.33 Q1.8 22.1,87.48 22.1,87.78 18.44,91.44 18.44,92.81 Q1.4
G_SENS
  Top 0.152: R8.2 58.83,31.7 58.83,29.57 60.2,28.19 Q2.4 60.2,28.04 64.01,24.23 64.01,22.71 Q2.8
GND  (via drill 0.35)  (1 unrouted)
  Top 0.152: v14.94,31.09 14.94,32.92 R15.1 | R18.1 7.62,12.34 10.06,12.34 R19.1 10.21,12.34 11.28,12.34 | 11.28,12.34 12.65,12.34 R20.2 12.8,12.5 13.72,13.41 20.27,13.41 SOLAR_IN.2 | 10.36,5.33 10.52,5.49 U$1.GND2 | 10.36,5.33 9.45,4.42 5.79,4.42 5.49,4.72 5.49,4.88 4.88,5.49 U$1.GND1 | 10.36,5.33 12.04,3.66 17.22,3.66 SOLAR_IN.3 17.37,3.5 28.35,3.5 SOLAR_IN.4 | 10.36,5.33 U$1.GND2 | 11.28,12.34 11.28,6.71 10.52,5.94 10.52,5.64 U$1.GND2 | R16.1 71.17,44.65 71.17,37.8 R17.1 71.02,37.64 69.49,37.64 65.84,33.98 65.84,31.85 R7.1 65.68,31.7 65.68,29.72 | 65.68,29.72 64.16,28.19 Q2.1 | 70.87,27.13 68.28,27.13 65.68,29.72 | 70.87,27.13 71.02,27.13 R11.1 70.87,27.13 | 70.87,27.13 70.87,12.8 I2C.5 | 54.41,12.8 56.24,12.8 DS18B20.3 | 54.41,12.8 DS18B20.5 | 39.01,24.23 39.78,24.23 40.54,24.99 C7.2 40.69,24.99 | 39.01,24.23 38.1,24.23 IC4.2 | 37.95,25.76 38.86,25.76 39.01,25.6 39.01,24.23 | 37.95,25.76 34.9,25.76 34.29,25.15 33.07,25.15 C8.2 | Q4.7 22.55,39.78 23.16,39.78 Q4.6 23.32,39.78 23.32,40.54 23.62,40.84 | 23.62,40.84 26.21,40.84 27.89,39.17 R14.1 28.04,39.01 30.63,39.01 32.31,37.34 32.31,37.03 IC2.3 32.46,36.88 32.92,36.42 32.92,35.97 | 32.92,35.97 32.92,34.29 IC2.9 | C9.2 53.34,33.83 52.58,33.07 50.9,33.07 IC5.2 50.75,33.07 47.85,33.07 47.09,33.83 45.72,33.83 C10.2 45.72,33.98 39.47,33.98 C4.2 39.32,33.98 37.95,33.98 | R12.2 35.2,40.54 35.2,37.19 35.05,37.03 IC2.1 35.05,36.88 | 35.05,36.88 37.95,33.98 | 32.92,35.97 34.14,35.97 35.05,36.88 | 37.95,33.98 37.95,25.76 | ESP_EN.2 ESP_EN.1 68.58,78.49 62.94,84.12 61.87,84.12 61.27,84.73 61.27,85.34 IC1.15 61.27,85.5 61.27,90.68 63.4,92.81 IC1.41
  Top 0.152: C1.2 64.77,72.39 JP4.4 | ESP_BOOT.2 74.83,58.06 74.83,61.57 73.46,62.94 73.46,66.6 74.83,67.97 ESP_RESET.1 74.83,68.12 73.76,69.19 73.76,73.61 JP1.4 | 65.99,92.96 65.99,95.25 IC1.43 65.99,95.4 65.99,97.84 IC1.44 | IC1.46 68.43,95.25 68.43,92.96 IC1.47 68.28,92.96 65.99,92.96 | 65.99,92.96 IC1.42 65.84,92.96 63.55,92.96 IC1.41 | IC1.41 63.4,92.96 63.4,95.25 IC1.40 | IC1.44 65.84,97.99 63.55,97.99 IC1.39 63.4,97.99 63.4,98.45 58.98,102.87 IC1.1 58.37,102.87 58.06,102.56 52.12,102.56 C3.1 51.97,102.41 51.02,101.46 C2.- 44.59,100.33 21.59,100.33 21.59,100.48 20.57,101.5 20.4,101.68 19.36,102.72 17.98,102.72 16.92,101.65 C6.2 | IC1.44 65.99,97.99 68.28,97.99 IC1.45 68.43,97.99 73.3,102.87 IC1.38 | 38.41,83.97 38.41,85.04 C14.2 38.41,85.19 38.41,87.63 C13.2 | 38.41,83.97 38.41,82.6 C15.2 38.56,82.45 38.86,82.14 38.86,79.7 U1.D14 | 38.41,83.97 33.07,83.97 C12.- 32.92,83.97 23.16,93.73 23.01,93.73 | 2.59,68.58 2.59,71.02 U1.GND2 2.59,71.17 2.59,72.08 15.54,85.04 15.54,99.52 17.22,101.19 | 17.22,101.19 16.92,101.5 C6.2 | 17.22,101.19 17.83,100.58 17.83,98.3 16.92,97.38 16.92,96.62 R6.1 16.92,96.47 17.98,95.4 19.36,95.4 21.03,97.08 21.03,97.38 21.18,97.54 22.86,97.54 23.77,96.62 R3.1 23.77,96.47 23.77,94.49 23.01,93.73 | 23.01,93.73 22.25,92.96 Q1.1 | 17.22,101.19 C6.2 | 23.62,40.84 23.62,47.55 2.59,68.58 | 2.59,68.58 U1.GND1 | FAN.1 53.49,18.9 53.49,16.64 54.41,15.72 54.41,12.8
  Bottom 0.152: v14.94,31.09 14.94,18.9 20.27,13.56 SOLAR_IN.2 | DS18B20.5 54.25,12.8 49.38,17.68 35.36,3.66 28.5,3.66 SOLAR_IN.4 | I2C.5 70.71,12.8 60.2,12.8 59.28,13.72 57.3,13.72 56.39,12.8 DS18B20.3 | JP4.4 ESP_EN.1 JP1.4 | U1.GND 49.84,85.34 45.26,80.77 40.08,80.77 39.01,79.7 U1.D14
  pour Top (isolate 0.254): 0,0 0,105.41 83.82,105.41 83.82,0
  pour Bottom (isolate 0.254): 0,0 83.82,0 83.82,105.41 0,105.41
I2C_SCL
  Top 0.152: IC1.36 75.44,100.28 76.05,100.28 81.23,95.1 81.23,79.7 R21.1 81.23,79.55 80.01,78.33 80.01,28.96 73,21.95 73,12.8 I2C.3
I2C_SDA  (via drill 0.35)
  Top 0.152: v78.64,82.75 78.64,79.7 R10.1 | v78.64,85.34 78.64,93.88 76.05,96.47 75.44,96.47 IC1.33
  Bottom 0.152: v78.64,85.34 v78.64,82.75 81.23,80.16 81.23,76.2 69.95,64.92 67.82,64.92 66.75,63.86 66.75,52.12 73.91,44.96 73.91,11.89 74.07,11.73 74.22,11.73 74.98,10.97 74.98,10.36 74.22,9.6 73.61,9.6 72.54,10.67 71.93,10.67 I2C.4
N$1  (via drill 0.35)
  Top 0.152: v68.58,60.2 SJ1.1 | v76.96,87.94 76.05,88.85 75.44,88.85 IC1.27
  Bottom 0.152: v68.58,60.2 68.58,61.27 81.53,74.22 81.53,83.36 v76.96,87.94
N$2  (via drill 0.35)
  Top 0.152: v60.81,80.77 60.81,78.49 49.68,67.36 49.68,50.29 50.29,49.68 55.78,49.68 56.54,50.44 56.54,50.75 SJ2.1 | v73.76,89.15 74.68,90.07 75.29,90.07 IC1.28
  Bottom 0.152: v60.81,80.77 69.19,89.15 v73.76,89.15
N$3
  Top 0.152: R5.2 16.76,99.06 16.76,98.3 15.85,97.38 15.85,89.92 18.29,87.48 Q1.5
N$4
  Top 0.152: R12.1 33.38,40.54 33.38,37.19 33.53,37.03 IC2.2
N$5
  Top 0.152: U$1.VBUS2 8.99,5.49 8.99,5.03 8.69,4.72 6.55,4.72 6.25,5.03 6.25,5.49 U$1.VBUS1 6.1,5.64 6.1,9.3 5.18,10.21 D2.2 5.03,10.36 2.9,10.36 2.59,10.67 SJ3.1
N$6  (via drill 0.35)
  Top 0.152: 54.41,25.15 54.41,25.2 | IC5.3 50.9,33.98 51.51,33.98 52.43,34.9 54.25,34.9 54.41,34.75 54.41,25.4 54.41,25.2 | 54.41,25.2 v53.34,24.13
  Bottom 0.152: v53.34,24.13 52.55,23.34 50.39,23.34 48.64,21.59 FAN.2
N$7
  Top 0.152: IC3.5 22.86,28.35 21.64,29.57 20.88,29.57 14.94,35.51 R13.1 14.94,35.66 14.94,38.1 C5.1
N$8
  Top 0.152: 3.35,1.98 3.35,5.49 U$1.SHIELD2 | R20.1 12.65,10.36 12.65,6.25 12.04,5.64 U$1.SHIELD3 | 3.35,1.98 11.89,1.98 U$1.SHIELD4 | 3.35,1.98 U$1.SHIELD1
  Bottom 0.152: U$1.SHIELD4 12.04,1.98 12.04,5.49 U$1.SHIELD3
N$9
  Top 0.152: IC3.2 22.86,30.02 23.32,29.57 24.23,29.57 27.89,33.22 27.89,37.03 R14.2
N$10
  Top 0.152: IC3.1 23.93,30.48 23.93,33.83 Q4.4
N$11
  Top 0.152: U$1.CC2 8.23,5.64 8.23,8.53 10.06,10.36 R19.2
N$12
  Top 0.152: IC3.3 21.79,30.48 21.79,32.61 21.34,33.07 21.34,36.58 23.77,39.01 23.77,39.62 Q4.5
N$13
  Top 0.152: U$1.CC1 7.16,5.64 7.16,9.91 7.62,10.36 R18.2
OUT+
  Top 0.152: D1.1 11.43,28.19 15.39,28.19 Q3.2 15.54,28.19 19.96,28.19 24.08,24.08 37.03,24.08 | C7.1 40.54,23.16 38.1,23.16 IC4.1 37.95,23.32 37.49,23.32 37.03,23.77 37.03,24.08 | 37.03,24.08 37.03,24.54 37.49,24.99 37.95,24.99 IC4.3
PSM_EINT_N  (via drill 0.35)
  Top 0.152: NB_PSM.2 74.98,34.75 76.2,33.53 76.2,29.26 76.05,29.11 73.91,29.11 71.17,31.85 71.17,35.81 R17.2 71.02,35.97 v68.73,35.97 | v70.71,91.44 IC1.29 | v52.58,79.4 50.9,77.72 U1.D11
  Bottom 0.152: v70.71,91.44 64.62,91.44 v52.58,79.4 | v68.73,35.97 61.57,35.97 49.68,47.85 49.68,76.66 50.75,77.72 U1.D11
RAIN_GAUGE_INPUT  (via drill 0.35)
  Top 0.152: IC1.26 73.61,87.63 69.65,91.59 v69.65,93.57
  Bottom 0.152: v69.65,93.57 58.06,93.57 50.9,86.41 50.29,86.41 49.38,85.5 49.38,85.34 45.11,81.08 38.86,81.08 37.8,80.01 37.8,14.78 39.78,12.8 RAIN_GAUGE.3
RESET_EN  (via drill 0.35)
  Top 0.152: 74.07,26.67 74.83,25.91 NB_RESET.2 | 74.07,26.67 71.93,28.8 71.17,28.8 R11.2 | v70.56,92.66 75.29,92.66 IC1.30 | 74.07,26.67 79.4,32 v79.4,71.17
  Bottom 0.152: U1.D13 60.66,92.66 v70.56,92.66 73.15,92.66 81.84,83.97 81.84,74.07 79.4,71.63 v79.4,71.17
SENS_VDD33
  Top 0.152: 58.37,21.64 59.28,21.64 60.2,22.55 Q2.5 | 58.37,21.64 55.63,21.64 R9.2 | 58.37,21.64 58.37,12.8 DS18B20.1
  Bottom 0.152: I2C.2 73.76,10.82 73.15,10.82 72.24,11.73 59.44,11.73 58.52,12.65 DS18B20.1
UART_MCU_RX
  Top 0.152: SJ1.2 55.02,48.31 50.9,48.31 U1.D0
  Bottom 0.152: JP4.3 63.4,76.2 63.4,75.74 51.97,64.31 51.97,49.38 50.9,48.31 U1.D0
UART_MCU_TX
  Top 0.152: U1.D1 50.9,50.9 55.02,50.9 SJ2.2 55.17,50.9 55.17,72.24 61.57,78.64 63.4,78.64 JP4.2
VDD33  (via drill 0.35)
  Top 0.152: IC1.2 58.37,101.5 57.76,101.5 57,100.74 52.12,100.74 C3.2 51.97,100.58 v49.53,100.58 | U1.VBAT 41.45,79.7 41.45,81.38 40.39,82.45 C15.1 40.39,82.6 40.39,85.04 C14.1 40.39,85.19 40.39,87.63 C13.1 40.23,87.63 39.17,88.7 33.07,88.7 C12.+ 33.02,90.17 34.29,91.44 44.2,91.44 v44.55,91.8 | 74.83,65.99 78.64,69.8 78.64,77.72 | 74.83,65.99 73.76,64.92 73.76,63.09 76.2,60.66 76.2,53.03 76.05,52.88 71.32,52.88 70.1,54.1 70.1,55.78 71.02,56.69 R2.2 | v80.62,76.5 81.23,77.11 81.23,77.72 R21.2 | v61.72,77.88 61.72,73.15 62.18,72.69 62.18,67.06 R1.2 | 78.64,77.72 72.39,77.72 71.78,78.33 71.78,79.4 JP1.1 | 78.64,77.72 R10.2 | C8.1 33.07,23.16 35.51,23.16 IC4.5 35.66,23.16 35.66,16.31 38.86,13.11 38.86,10.82 RAIN_GAUGE.4 38.86,10.67 38.86,8.84 42.98,4.72 52.88,4.72 64.77,16.61 64.77,25.45 63.25,26.98 | R8.1 60.66,31.7 60.66,29.26 61.72,28.19 Q2.3 61.72,28.04 61.72,27.74 62.48,26.98 63.25,26.98 | NB_RESET.1 74.83,30.02 74.83,32.92 73.76,33.98 73.76,37.8 74.83,38.86 NB_PSM.1 74.98,39.01 76.2,40.23 76.2,44.35 74.98,45.57 74.98,47.7 NB_BOOT.1 | 63.25,26.98 63.55,27.28 63.55,29.72 64.77,30.94 64.77,42.06 70.41,47.7 74.83,47.7 NB_BOOT.1 | 74.83,65.99 76.81,64.01 76.81,49.68 74.98,47.85 NB_BOOT.1 | v44.55,91.8 44.55,78.84 v44.45,78.74 | v44.55,91.8 44.55,92.81 45.72,93.98 C2.+
  Bottom 0.152: v49.53,100.58 49.53,96.77 v44.55,91.8 | v80.62,76.5 78.49,76.5 73.76,81.23 JP1.1 73.61,81.23 63.55,81.23 JP4.1 63.4,81.23 61.72,79.55 61.72,78.79 | 61.72,78.79 v61.72,77.88 | 61.72,78.79 44.5,78.79 v44.45,78.74 | 41.6,79.55 U1.VBAT
VDD_FAN
  Top 0.152: C10.1 45.72,32 48.16,32 IC5.5 48.31,32 48.31,25.3 49.68,23.93 49.68,14.33 53.19,10.82 DS18B20.6
VIN  (via drill 0.35)
  Top 0.152: SJ3.2 2.59,12.19 2.9,12.5 5.03,12.5 D2.1 5.18,12.65 5.18,19.36 10.82,24.99 | R15.2 12.95,32.92 11.43,31.39 D1.2 11.43,30.33 11.89,29.87 | 11.89,29.87 12.8,28.96 16.15,28.96 16.46,28.65 18.29,28.65 18.44,28.8 18.44,29.72 18.14,30.02 15.54,30.02 Q3.1 | 10.82,24.99 10.82,28.8 11.89,29.87 | C9.1 53.34,32 50.9,32 IC5.1 50.75,32.16 50.29,32.16 49.84,32.61 47.85,32.61 47.4,33.07 44.96,33.07 44.04,32.16 | 44.04,32.16 39.47,32.16 C4.1 | 44.04,32.16 44.04,29.21 44.04,29.11 44.04,23.27 FAN.3 | 30.63,30.48 34.14,30.48 34.9,31.24 34.9,31.55 IC2.8 | 30.63,30.48 30.18,30.94 30.18,35.97 31.09,36.88 IC2.4 | v30.63,24.69 30.63,30.48 | 10.82,24.99 13.87,24.99 25.3,13.56 SOLAR_IN.1
  Bottom 0.152: v30.63,24.69 30.63,18.75 30.48,18.59 | 30.48,18.59 25.45,13.56 SOLAR_IN.1 | 30.48,18.59 37.34,11.73 40.39,11.73 40.84,12.19 40.84,18.9 43.54,21.59 FAN.3
VOL_SENS
  Top 0.152: 18.75,99.06 18.75,98.75 | 18.75,98.75 18.75,96.62 R6.2 | 18.75,99.06 18.75,101.5 C6.1 | 18.75,99.06 R5.1 18.75,98.75 | 18.75,98.75 47.4,98.75 49.53,96.62 58.37,96.62 IC1.6

### Text on the board
tPlace: JLCJLCJLCJLC
tNames: Jiri Jilek / NB_RainGauge_V0.1 / 2022